# Altium project playA.PrjPcb
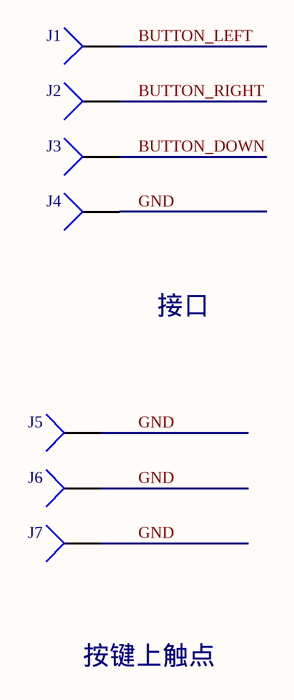
[diagram p0: playA.SchDoc]
1 sheet, 7 parts. Net scope: global (net labels, ports and power ports of the same name join across sheets).
Board file: playA.PcbDoc

## Sheet playA.SchDoc
size A4

### Parts
J1  PAD  [LINK_PAD]  (value not drawn)
J2  PAD  [LINK_PAD]  (value not drawn)
J3  PAD  [LINK_PAD]  (value not drawn)
J4  PAD  [LINK_PAD]  (value not drawn)
J5  PAD  [Button_Pad]  (value not drawn)
J6  PAD  [Button_Pad]  (value not drawn)
J7  PAD  [Button_Pad]  (value not drawn)

### Nets
BUTTON_DOWN: J3.1
BUTTON_LEFT: J1.1
BUTTON_RIGHT: J2.1
GND: J4.1 J5.1 J6.1 J7.1

### Notes on the sheet
- 接口
- 按键上触点

### Library data of the parts
J1-J7 = Socket: LatestRevisionDate: 17-Jul-2002; LatestRevisionNote: Re-released for DXP Platform.; Publisher: Altium Limited